# Altium schematic sheet LED_schematic.SchDoc
size A4
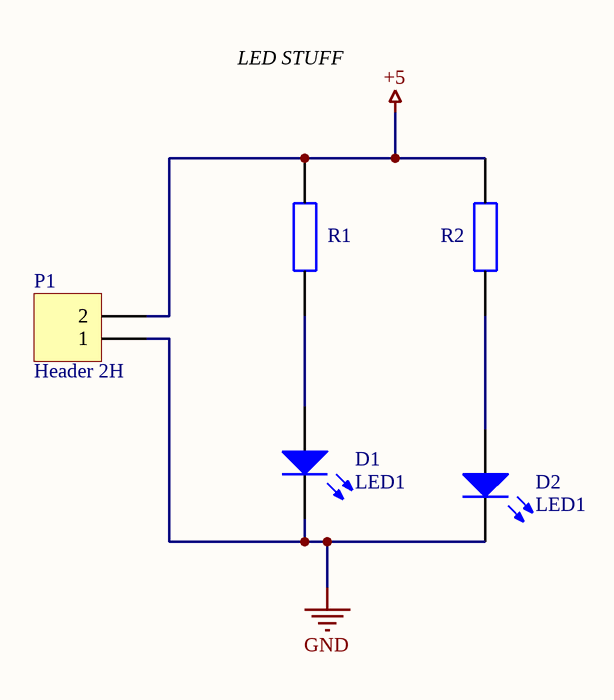
[diagram p0: LED_schematic.SchDoc]

## Parts
D1  LED1  [LED-1]
D2  LED1  [LED-1]
P1  Header 2H  [HDR1X2H]
R1  KTR10EZPF5103  [RESC2012X65N]  (value not drawn)
R2  KTR10EZPF5103  [RESC2012X65N]  (value not drawn)

## Nets
+5: P1.2 R1.2 R2.2
GND: D1.2(K) D2.2(K) P1.1
NetD1_1: D1.1(A) R1.1
NetD2_1: D2.1(A) R2.1

## Notes on the sheet
- LED STUFF

## Library data of the parts
D1 D2 = LED1: Typical RED GaAs LED; Published: 8-Jun-2000; LatestRevisionDate: 08-Jul-2005; LatestRevisionNote: Mech Layer 1 removed.; PackageReference: LED-1; Publisher: Altium Limited; PackageDescription: LED; 2 Leads
P1 = Header 2H: Header, 2-Pin, Right Angle; LatestRevisionDate: 17-Jul-2002; LatestRevisionNote: Re-released for DXP Platform.; Publisher: Altium Limited
R1 R2 = KTR10EZPF5103: Thick Film Resistors - SMD 0805 510Kohm 1% High VoltageAEC-Q200; Manufacturer_Name: ROHM Semiconductor; Geometry.Height: 0.65mm; Manufacturer_Part_Number: KTR10EZPF5103; RS Part Number: *; RS Price/Stock: *; Arrow Part Number: KTR10EZPF5103; Arrow Price/Stock: https://www.arrow.com/en/products/ktr10ezpf5103/rohm-semiconductor; Datasheet Link: http://rohmfs.rohm.com/en/products/databook/datasheet/passive/resistor/chip_resistor/ktr.pdf